# Altium project Segway_Charging_Board.PrjPcb
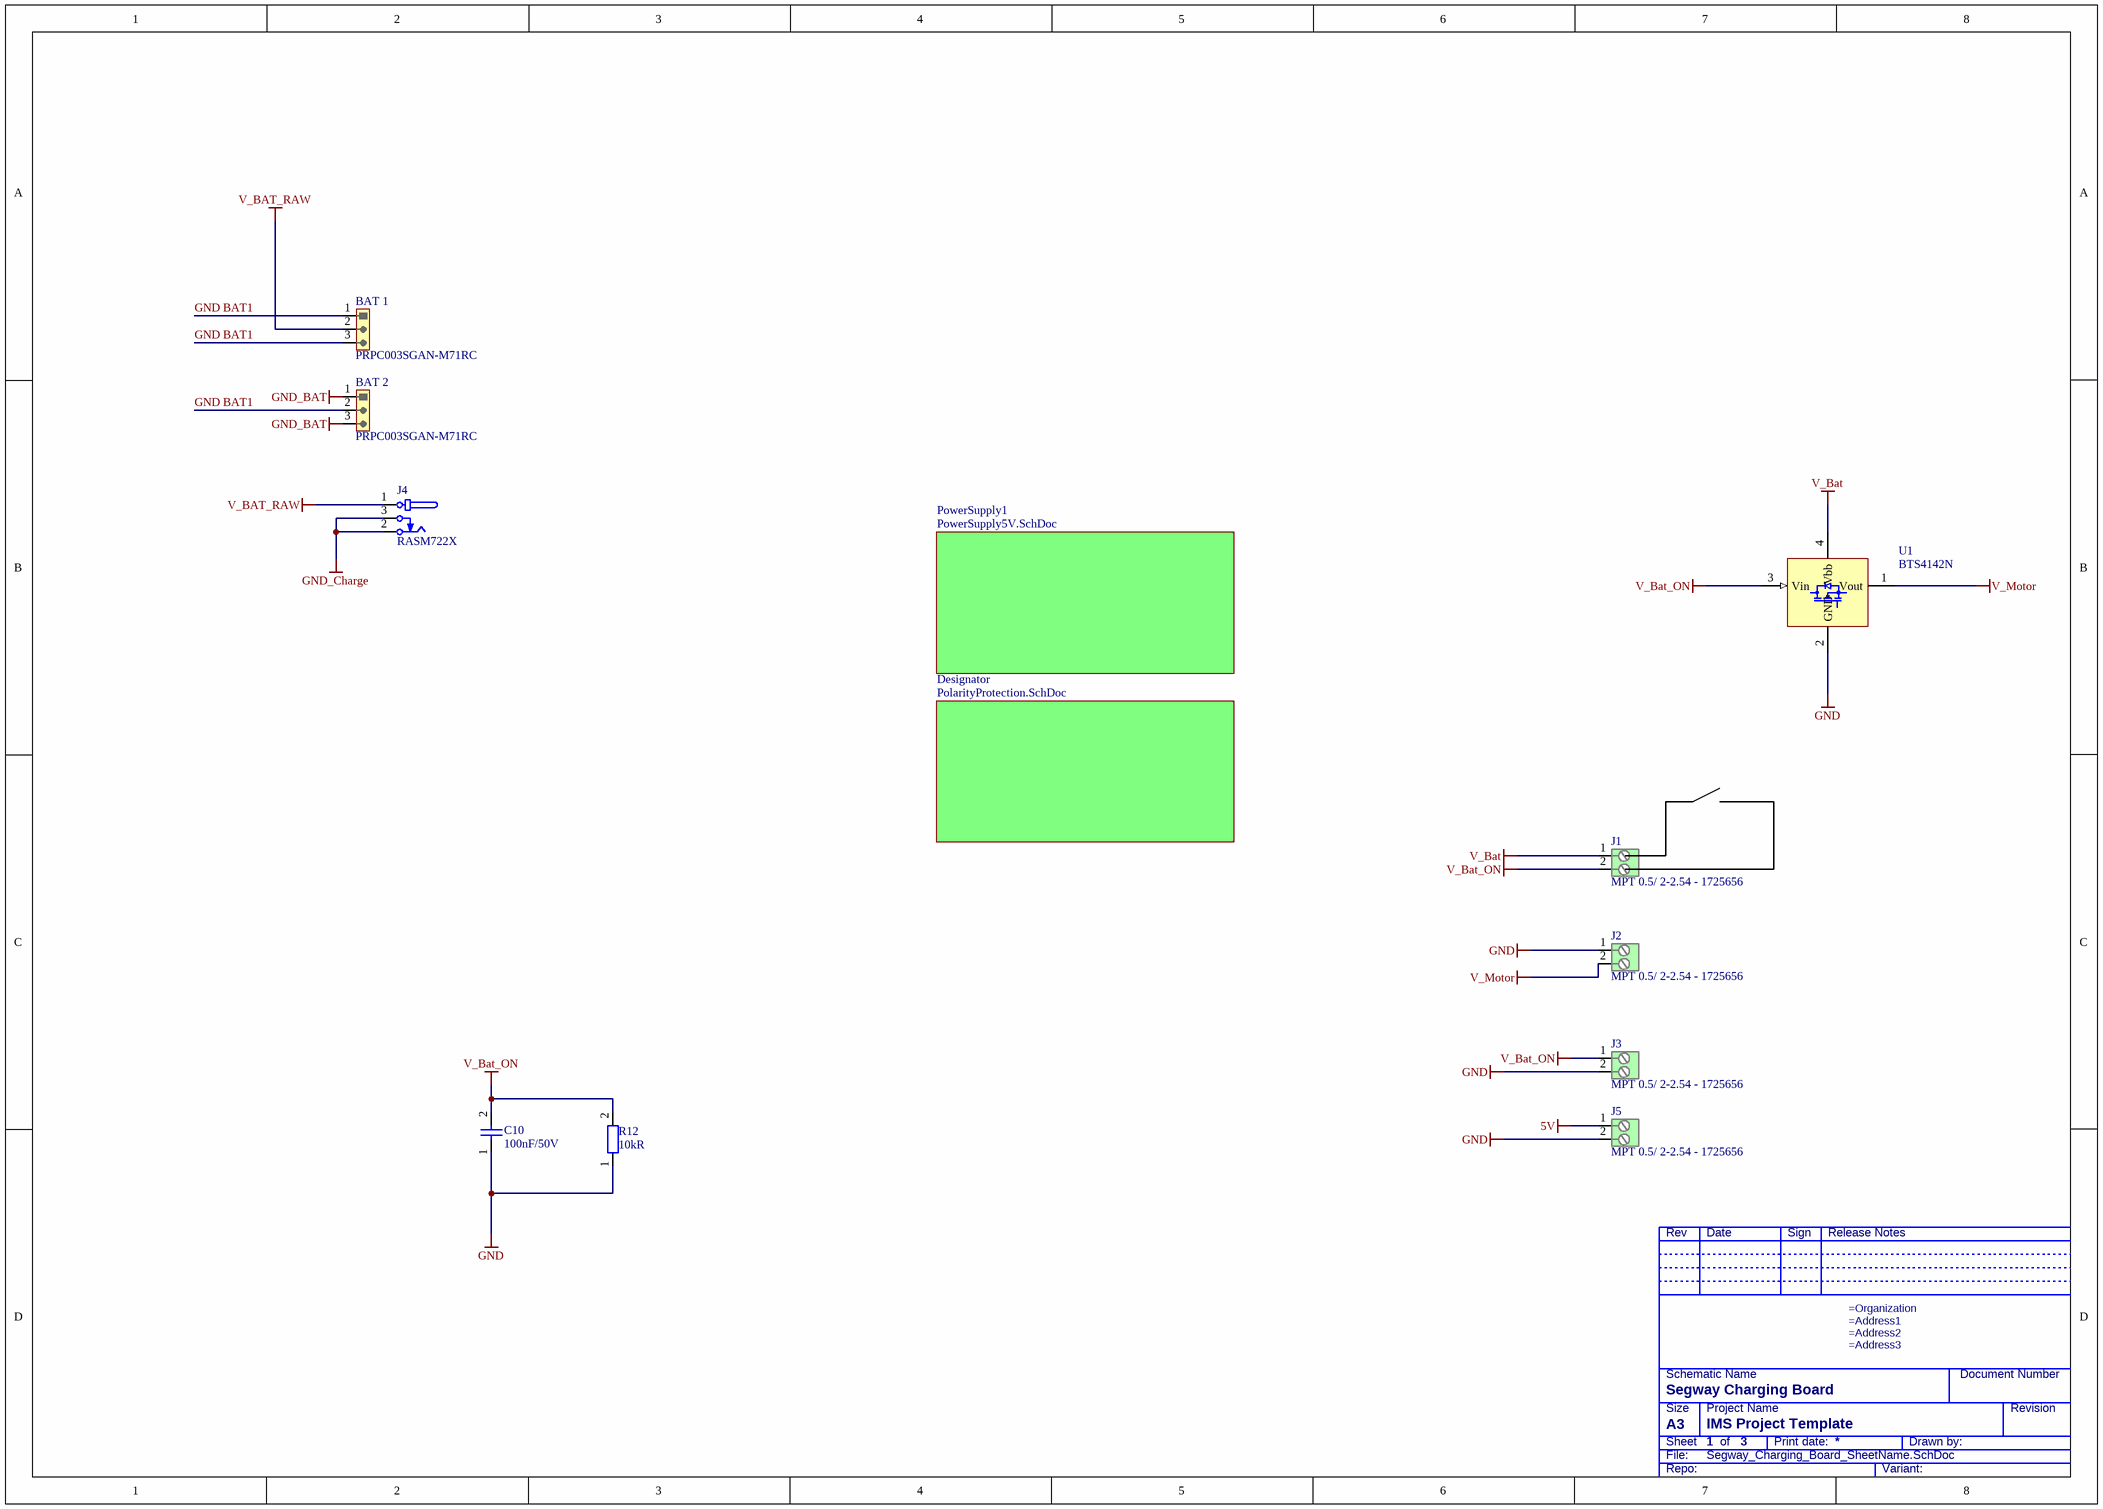
[diagram p0: Segway_Charging_Board_SheetName.SchDoc]
ProjectAddress1: Technikumstrasse 9; ProjectAddress2: CH - 8401 Winterthur; ProjectAuthor: szar; ProjectCompany: Zurich University of Applied Sience; ProjectCompanyShort: ZHAW - IMS; ProjectDocumentNumber: 2024071101; ProjectInstitute: IMS - Institute of Mechatronic Systems; ProjectNameFull: IMS Project Template; ProjectRepository: If used; ProjectRevision: V1.0
3 sheets, 43 parts. Net scope: global (net labels, ports and power ports of the same name join across sheets).
Board file: Segway_Charging_Board_PCB.PcbDoc
Sheets:
  Segway_Charging_Board_SheetName.SchDoc
    PowerSupply1 = PowerSupply5V.SchDoc
    Designator = PolarityProtection.SchDoc

## Sheet Segway_Charging_Board_SheetName.SchDoc: Segway Charging Board
size A3; ENG_APP_DATE: --/--/--; DSN_APP_DATE: --/--/--; CHK_APP_DATE: --/--/--; Author: szar; CompanyName: ZHAW - IMS; Organization: Zurich University of Applied Sience; Address1: IMS - Institute of Mechatronic Systems; Address2: Technikumstrasse 9; Address3: CH - 8401 Winterthur; DocumentNumber: 2024071101_1; Revision: V1.0; SheetNumber: 1; SheetTotal: 3; Repository: If used

### Parts
BAT_1  PRPC003SGAN-M71RC  [HD254_1x3_MH]
BAT_2  PRPC003SGAN-M71RC  [HD254_1x3_MH]
C10  100nF/50V  [CAPC1005X05L]
J1  MPT 0.5/ 2-2.54 - 1725656  [PHOENIX_1725656]
J2  MPT 0.5/ 2-2.54 - 1725656  [PHOENIX_1725656]
J3  MPT 0.5/ 2-2.54 - 1725656  [PHOENIX_1725656]
J4  RASM722X  [SWITCHCRAFT_RASM722X]
J5  MPT 0.5/ 2-2.54 - 1725656  [PHOENIX_1725656]
R12  10kR  [RESC1005X04L]
U1  BTS4142N  [SOT230P700X180-4L]

### Sub-sheets
Designator = PolarityProtection.SchDoc: no entries
PowerSupply1 = PowerSupply5V.SchDoc: no entries

### Nets
5V: J5.1
GND: C10.1 J2.1 J3.2 J5.2 R12.1 U1.2(GND)
GND_BAT: BAT_2.1 BAT_2.3
GND_Charge: J4.2(TIP) J4.3(SHUNT)
V_Bat: J1.1 U1.4(Vbb)
V_Bat_ON: C10.2 J1.2 J3.1 R12.2 U1.3(Vin)
V_BAT_RAW: BAT_1.2 J4.1(SLEEVE)
V_Motor: J2.2 U1.1(Vout)
GND BAT1: BAT_1.1 BAT_1.3 BAT_2.2

### Notes on the sheet
- Rev
- Date
- Sign
- Release Notes
- Schematic Name
- Document Number
- File:
- Sheet
- Size
- A3
- Project Name
- of
- Print date:
- Drawn by:
- Revision
- Repo:
- Variant:

### Library data of the parts
BAT_1 BAT_2 = CMP-002-00172-18: Header, 1x3Pin, Pitch 2.54mm, Male, Horizontal, THT; Manufacturer: Sullins Connector Solutions; Mating Length: 8.08m; Pin Mapping: 1x3; Overall Contact Length: 0mm; Mounting Technology: THT; Pins: 3; Pitch Row: 2.54mm; Gender: Male; Pitch: 2.54mm; Termination Length: 3.05mm; Angle: Horizontal; Insulation Height: 2.5mm
C10 = CMP-001-00067-18: Cap MLCC, 100nF, 50V, X7R, 10%, 0402; Case/Package: 0402; Voltage Rating: 50V; Dielectricum: X7R; Mounting Technology: SMD; Type: MLCC; Tolerance: 10%; Case Code (Metric): 1005; Value: 100nF
J1-J3 J5 = CMP-070-000011-17: Wire to Board, Screw, 2 Pin, Pitch 2.54mm, 6A, 160V, Horizontal, THT, L6.2B5.54H12; Manufacturer: Phoenix; Pin Mapping: 1x2; Type: Wire to Board; Connection: Screw; Max Voltage: 160V; Pins: 2; Pitch: 2.54mm; Max Current: 6A; Mounting Technology: THT; Angle: Horizontal; Family Name: MPT; Size: L6.2B5.54H12
J4 = CMP-002-00013-23: Barrel Power Jack, 3 Pin, Male, 5A, 250V, Horizontal, SMD, L14.4B9H11, Diameter 2.0/5.5mm; Mating Part: S760; Manufacturer: Switchcraft; Pin Mapping: 2+1; Pitch: 0mm; Connection: Pluggable; Size: L14.5B9H11; Mounting Technology: SMD; Type: Jack; Angle: Horizontal; Max Voltage: 250V; Pins: 3; Gender: Male; Max Current: 5A
R12 = CMP-009-00149-32: Res, 10kR, 1%, 0.1W, 0402; Power: 100mW; Value: 10k; Voltage Rating: 50V; Case/Package: 0402; Type: Fixed; Mounting Technology: SMD; Case Code (Metric): 1005; Tolerance: 1%
U1 = CMP-013-00047-18: High-Side Switch, 1 Ch, 12..45V, 1.4A, SOT-223-4; Max Power Voltage: 45V; Min Power Voltage: 12V; Channels: 1; Max Current: 1.4A; Function: High-Side Switch; Mounting Technology: SMD; Max Logic Voltage: 45V; Case/Package: SOT-223-4; Min Logic Voltage: 12V

## Sheet PowerSupply5V.SchDoc
size A3; SheetNumber: 2; SheetTotal: 3
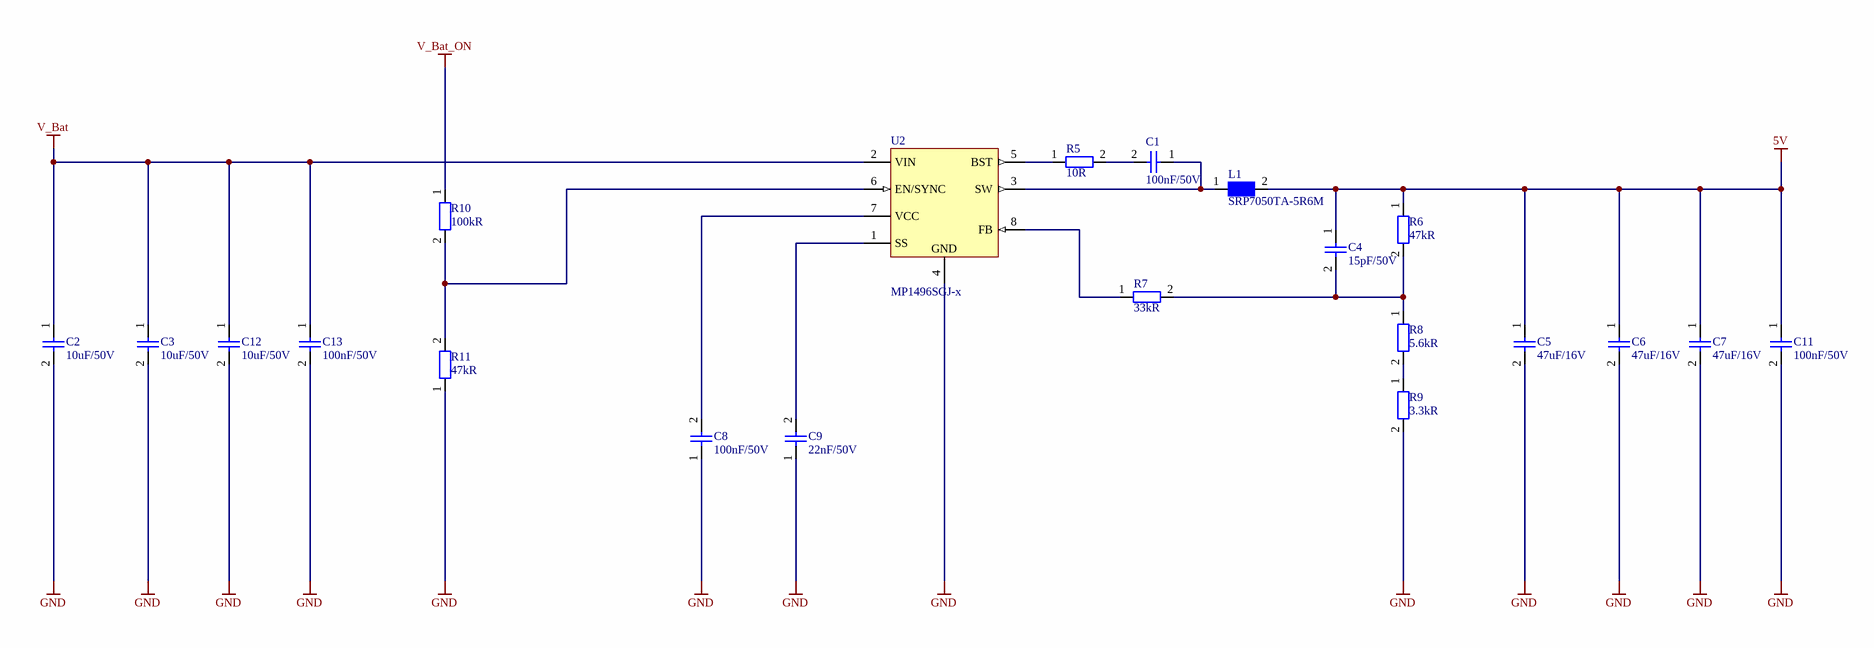
[diagram p1: PowerSupply5V.SchDoc]

### Parts
C1  100nF/50V  [CAPC1005X05L]
C2  10uF/50V  [CAPC3225X25L]
C3  10uF/50V  [CAPC3225X25L]
C4  15pF/50V  [CAPC1005X05L]
C5  47uF/16V  [CAPC3225X25L]
C6  47uF/16V  [CAPC3225X25L]
C7  47uF/16V  [CAPC3225X25L]
C8  100nF/50V  [CAPC1005X05L]
C9  22nF/50V  [CAPC1005X05L]
C11  100nF/50V  [CAPC1005X05L]
C12  10uF/50V  [CAPC3225X25L]
C13  100nF/50V  [CAPC1005X05L]
L1  SRP7050TA-5R6M  [INDP7366X50L]
R5  10R  [RESC1005X04L]
R6  47kR  [RESC1005X04L]
R7  33kR  [RESC1005X04L]
R8  5.6kR  [RESC1005X04L]
R9  3.3kR  [RESC1005X04L]
R10  100kR  [RESC1005X04L]
R11  47kR  [RESC1005X04L]
U2  MP1496SGJ-x  [TSOP65P280X100-8L]

### Nets
5V: C4.1 C5.1 C6.1 C7.1 C11.1 L1.2 R6.1
GND: C2.2 C3.2 C5.2 C6.2 C7.2 C8.1 C9.1 C11.2 C12.2 C13.2 R9.2 R11.1 U2.4(GND)
V_Bat: C2.1 C3.1 C12.1 C13.1 U2.2(VIN)
V_Bat_ON: R10.1
NetC1_1: C1.1 L1.1 U2.3(SW)
NetC1_2: C1.2 R5.2
NetC4_2: C4.2 R6.2 R7.2 R8.1
NetC8_2: C8.2 U2.7(VCC)
NetC9_2: C9.2 U2.1(SS)
NetR5_1: R5.1 U2.5(BST)
NetR7_1: R7.1 U2.8(FB)
NetR8_2: R8.2 R9.1
NetR10_2: R10.2 R11.2 U2.6(EN/SYNC)

### Notes on the sheet
- Schematic Name
- Document Number
- File:
- Sheet
- Size
- A3
- Project Name
- of
- Print date:
- Drawn by:
- Revision
- Repo:
- Variant:

### Library data of the parts
C1 C8 C11 C13 = CMP-001-00067-18: Cap MLCC, 100nF, 50V, X7R, 10%, 0402; Case/Package: 0402; Voltage Rating: 50V; Dielectricum: X7R; Mounting Technology: SMD; Type: MLCC; Tolerance: 10%; Case Code (Metric): 1005; Value: 100nF
C2 C3 C12 = CMP-00032-8: Cap MLCC, 10uF, 50V, X7R, 20%, 1210; Value: 10µF; Type: MLCC; Voltage Rating: 50V; Case/Package: 1210; Mounting Technology: SMD; Dielectricum: X7R; Tolerance: 20%; Case Code (Metric): 3525
C4 = CMP-00153-5: Cap MLCC, 15pF, 50V, C0G, 5%, 0402; Mounting Technology: SMD; Tolerance: 5%; Type: MLCC; Voltage Rating: 50V; Case Code (Metric): 1005; Case/Package: 0402; Value: 15pF; Dielectricum: C0G
C5-C7 = CMP-001-00097-16: Cap MLCC, 47uF, 16V, X5R, 20%, 1210; Value: 47µF; Dielectricum: X5R; Case Code (Metric): 3525; Voltage Rating: 16V; Case/Package: 1210; Tolerance: 20%; Mounting Technology: SMD; Type: MLCC
C9 = CMP-001-00062-18: Cap MLCC, 22nF, 50V, X7R, 10%, 0402; Dielectricum: X7R; Value: 22nF; Voltage Rating: 50V; Tolerance: 10%; Case/Package: 0402; Type: MLCC; Mounting Technology: SMD; Case Code (Metric): 1005
L1 = CMP-006-00040-7: Coil, 5.6uH, 49mR, 6A, 20%, 6A, 2626; Resistance DC: 49m; Inductivity: 5.6µH; Mounting Technology: SMD; Tolerance: 20%; Current: 6A; Case/Package: 2626
R5 = CMP-009-00152-29: Res, 10R, 1%, 0.063W, 0402; Voltage Rating: 50V; Value: 10; Power: 63mW; Mounting Technology: SMD; Case/Package: 0402; Tolerance: 1%; Type: Fixed; Case Code (Metric): 1005
R6 R11 = CMP-009-00137-31: Res, 47kR, 1%, 0.063W, 0402; Voltage Rating: 50V; Value: 47k; Power: 63mW; Type: Fixed; Mounting Technology: SMD; Tolerance: 1%; Case/Package: 0402; Case Code (Metric): 1005
R7 = CMP-009-00028-32: Res, 33kR, 1%, 0.063W, 0402; Power: 63mW; Voltage Rating: 50V; Value: 33k; Case/Package: 0402; Tolerance: 1%; Mounting Technology: SMD; Type: Fixed; Case Code (Metric): 1005
R8 = CMP-009-00136-30: Res, 5.6kR, 1%, 0.063W, 0402; Voltage Rating: 50V; Power: 63mW; Value: 5.6k; Type: Fixed; Tolerance: 1%; Case Code (Metric): 1005; Case/Package: 0402; Mounting Technology: SMD
R9 = CMP-009-00085-21: Res, 3.3kR, 1%, 0.063W, 0402; Power: 63mW; Value: 3.3k; Voltage Rating: 50V; Case/Package: 0402; Tolerance: 1%; Type: Fixed; Mounting Technology: SMD; Case Code (Metric): 1005
R10 = CMP-009-00022-33: Res, 100kR, 1%, 0.1W, 0402; Voltage Rating: 50V; Value: 100k; Power: 100mW; Type: Fixed; Case Code (Metric): 1005; Mounting Technology: SMD; Case/Package: 0402; Tolerance: 1%
U2 = CMP-00363-5: Buck Converter, 0.8..15.2V, 2A, 4.5..16Vin, TSOP-8; Max In Voltage: 16V; Min Out Voltage: 800mV; Max Out Voltage: 15.2V; Frequency: 500kHz; Min In Voltage: 4.5V; Max Out Current: 2A; Case/Package: TSOP-8; Mounting Technology: SMD

## Sheet PolarityProtection.SchDoc
size A4; SheetNumber: 3; SheetTotal: 3
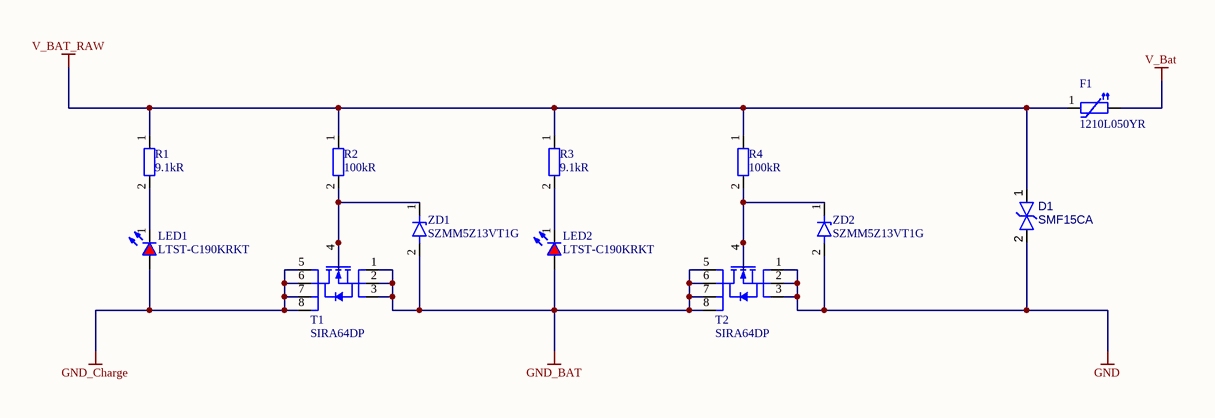
[diagram p2: PolarityProtection.SchDoc]

### Parts
D1  SMF15CA  [SODFL370X110-2L]
F1  1210L050YR  [FUSER3225X08L]
LED1  LTST-C190KRKT  [LEDSC160X80X80-2Lrd]
LED2  LTST-C190KRKT  [LEDSC160X80X80-2Lrd]
R1  9.1kR  [RESC1608X06L]
R2  100kR  [RESC1608X06L]
R3  9.1kR  [RESC1608X06L]
R4  100kR  [RESC1608X06L]
T1  SIRA64DP  [SON127P620X110-9T400X365L]
T2  SIRA64DP  [SON127P620X110-9T400X365L]
ZD1  SZMM5Z13VT1G  [SODFL160X70-2L]
ZD2  SZMM5Z13VT1G  [SODFL160X70-2L]

### Nets
GND: D1.2(A) T2.1(S) T2.2(S) T2.3(S) ZD2.2(Anode)
GND_BAT: LED2.2(A) T1.1(S) T1.2(S) T1.3(S) T2.5(D) T2.6(D) T2.7(D) T2.8(D) ZD1.2(Anode)
GND_Charge: LED1.2(A) T1.5(D) T1.6(D) T1.7(D) T1.8(D)
V_Bat: F1.2
V_BAT_RAW: D1.1(A) F1.1 R1.1 R2.1 R3.1 R4.1
NetLED1_1: LED1.1(K) R1.2
NetLED2_1: LED2.1(K) R3.2
NetR2_2: R2.2 T1.4(G) ZD1.1(Cathode)
NetR4_2: R4.2 T2.4(G) ZD2.1(Cathode)

### Library data of the parts
D1 = CMP-004-00062-15: TVS Diode, bidirectional, 15V, 8.2A, 200W, SOD-123FL-2; Connection: single; Case/Package: SOD-123FL-2; Peak Current: 8.2A; Rated Voltage: 15V; Peak Power: 200W; Size: 0; Mounting Technology: SMD; Direction: bidirectional
F1 = CMP-00093-10: Resettable Fuse, Ihold 500mA, Itrip 1A, 13.2V, 1210; Mounting Technology: SMD; Ihold: 500mA; Itrip: 1A; Voltage Rating: 13.2V; Case/Package: 1210
LED1 LED2 = CMP-007-00024-16: LED, Red, 20mA, 2.0V, 0603; Forward Voltage: 2V; Case/Package: 0603; Mounting Technology: SMD; Color: Red; Rated Current: 20mA; Size: L1.6B0.8H0.8
R1 R3 = CMP-009-00472-1: Res, 9.1kR, 1%, 0.1W, 0603; Power: 100mW; Voltage Rating: 75V; Value: 9.1k; Tolerance: 1%; Case Code (Metric): 1608; Mounting Technology: SMD; Case/Package: 0603; Type: Fixed
R2 R4 = CMP-009-00023-30: Res, 100kR, 1%, 0.1W, 0603; Voltage Rating: 50V; Power: 100mW; Value: 100k; Type: Fixed; Case/Package: 0603; Mounting Technology: SMD; Case Code (Metric): 1608; Tolerance: 1%
T1 T2 = CMP-013-00069-15: MOSFET N-Enh, 30V, 60A, 100Ap, 2.1mR, 27.8W, SO-8; Current peak: 100A; Resistance: 2.1m; Case/Package: PowerPAK-SO-8; Power: 27.8W; Voltage: 30V; Current: 60A; Type: MOSFET; Technology: N-enh; Mounting Technology: SMD
ZD1 ZD2 = CMP-004-00080-13: Zener Diode, 13.25V±0.85V, 5mA, 30R, 500mW, SOD-523-2; Voltage: 13.25V; Current: 100nA; Mounting Technology: SMD; Power: 500mW; Type: Zener; Case/Package: SOD-523-2

## Nets that join several sheets
5V: Segway_Charging_Board_SheetName (J5.1), PowerSupply5V (7 pins)
GND: Segway_Charging_Board_SheetName (6 pins), PowerSupply5V (13 pins), PolarityProtection (5 pins)
GND_BAT: Segway_Charging_Board_SheetName (BAT_2.1 BAT_2.3), PolarityProtection (9 pins)
GND_Charge: Segway_Charging_Board_SheetName (J4.2 J4.3), PolarityProtection (5 pins)
V_Bat: Segway_Charging_Board_SheetName (J1.1 U1.4), PowerSupply5V (5 pins), PolarityProtection (F1.2)
V_Bat_ON: Segway_Charging_Board_SheetName (5 pins), PowerSupply5V (R10.1)
V_BAT_RAW: Segway_Charging_Board_SheetName (BAT_1.2 J4.1), PolarityProtection (6 pins)